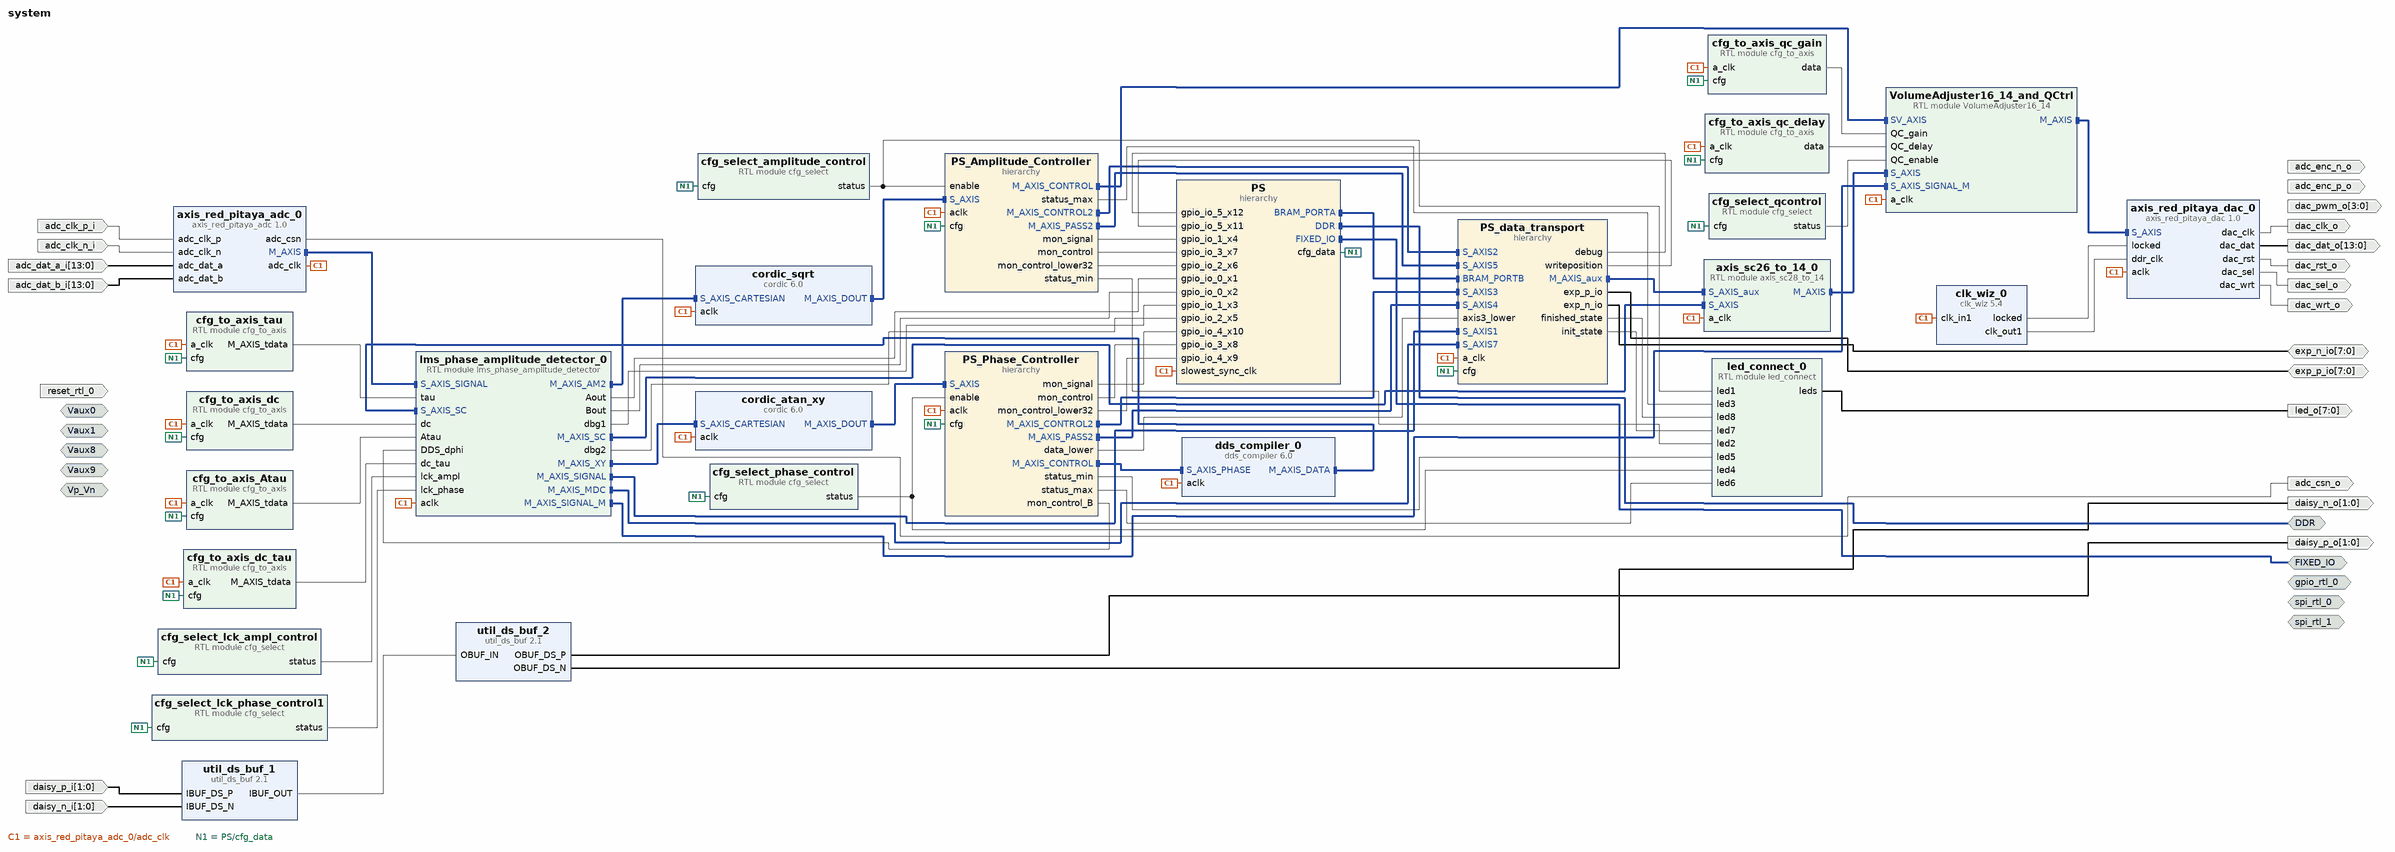
[diagram p0: block diagram of the top level]
# Vivado block design system, xc7z010clg400-1, Vivado 2017.4
create_bd_design system

create_bd_intf_port -mode Master -vlnv xilinx.com:interface:ddrx_rtl:1.0 DDR
create_bd_intf_port -mode Master -vlnv xilinx.com:display_processing_system7:fixedio_rtl:1.0 FIXED_IO
create_bd_intf_port -mode Master -vlnv xilinx.com:interface:spi_rtl:1.0 spi_rtl_0
create_bd_intf_port -mode Slave -vlnv xilinx.com:interface:diff_analog_io_rtl:1.0 Vp_Vn
create_bd_intf_port -mode Slave -vlnv xilinx.com:interface:diff_analog_io_rtl:1.0 Vaux0
create_bd_intf_port -mode Slave -vlnv xilinx.com:interface:diff_analog_io_rtl:1.0 Vaux1
create_bd_intf_port -mode Slave -vlnv xilinx.com:interface:diff_analog_io_rtl:1.0 Vaux9
create_bd_intf_port -mode Slave -vlnv xilinx.com:interface:diff_analog_io_rtl:1.0 Vaux8
create_bd_intf_port -mode Master -vlnv xilinx.com:interface:gpio_rtl:1.0 gpio_rtl_0
create_bd_intf_port -mode Master -vlnv xilinx.com:interface:spi_rtl:1.0 spi_rtl_1
create_bd_port -dir O adc_enc_p_o
create_bd_port -dir O adc_enc_n_o
create_bd_port -dir O -from 3 -to 0 dac_pwm_o
create_bd_port -dir I -type rst reset_rtl_0
set_property -dict {CONFIG.POLARITY ACTIVE_HIGH} [get_bd_ports reset_rtl_0]
create_bd_port -dir I adc_clk_p_i
create_bd_port -dir I adc_clk_n_i
create_bd_port -dir I -from 1 -to 0 daisy_p_i
create_bd_port -dir I -from 1 -to 0 daisy_n_i
create_bd_port -dir O -from 1 -to 0 daisy_p_o
create_bd_port -dir O -from 1 -to 0 daisy_n_o
create_bd_port -dir I -from 13 -to 0 adc_dat_a_i
create_bd_port -dir I -from 13 -to 0 adc_dat_b_i
create_bd_port -dir O dac_rst_o
create_bd_port -dir O dac_sel_o
create_bd_port -dir O dac_wrt_o
create_bd_port -dir O dac_clk_o
create_bd_port -dir O -from 13 -to 0 dac_dat_o
create_bd_port -dir O adc_csn_o
create_bd_port -dir O -from 7 -to 0 led_o
create_bd_port -dir IO -from 7 -to 0 exp_p_io
create_bd_port -dir IO -from 7 -to 0 exp_n_io

create_bd_cell -type ip -vlnv xilinx.com:ip:util_ds_buf:2.1 util_ds_buf_1
set_property -dict {CONFIG.C_SIZE 2} [get_bd_cells util_ds_buf_1]
create_bd_cell -type ip -vlnv xilinx.com:ip:util_ds_buf:2.1 util_ds_buf_2
set_property -dict {CONFIG.C_SIZE 2 CONFIG.C_BUF_TYPE OBUFDS} [get_bd_cells util_ds_buf_2]
create_bd_cell -type ip -vlnv pavel-demin:user:axis_red_pitaya_adc:1.0 axis_red_pitaya_adc_0
create_bd_cell -type ip -vlnv pavel-demin:user:axis_red_pitaya_dac:1.0 axis_red_pitaya_dac_0
create_bd_cell -type hier PS
create_bd_cell -type hier PS_Amplitude_Controller
create_bd_cell -type hier PS_Phase_Controller
create_bd_cell -type hier PS_data_transport
create_bd_cell -type module -reference cfg_select cfg_select_amplitude_control
set_property -dict {CONFIG.SRC_ADDR 3 CONFIG.CFG_SWBIT 1} [get_bd_cells cfg_select_amplitude_control]
create_bd_cell -type module -reference cfg_select cfg_select_phase_control
set_property -dict {CONFIG.SRC_ADDR 3} [get_bd_cells cfg_select_phase_control]
create_bd_cell -type ip -vlnv xilinx.com:ip:clk_wiz:5.4 clk_wiz_0
set_property -dict [list \
  CONFIG.PRIM_IN_FREQ 125 \
  CONFIG.USE_INCLK_SWITCHOVER false \
  CONFIG.SECONDARY_SOURCE Single_ended_clock_capable_pin \
  CONFIG.CLKIN1_JITTER_PS 80.0 \
  CONFIG.CLKIN2_JITTER_PS 166.66 \
  CONFIG.CLKOUT1_REQUESTED_OUT_FREQ 250 \
  CONFIG.USE_RESET false \
  CONFIG.MMCM_DIVCLK_DIVIDE 1 \
  CONFIG.MMCM_CLKFBOUT_MULT_F 8.000 \
  CONFIG.MMCM_CLKIN1_PERIOD 8.000 \
  CONFIG.MMCM_CLKIN2_PERIOD 10.000 \
  CONFIG.MMCM_CLKOUT0_DIVIDE_F 4.000 \
  CONFIG.CLKOUT1_JITTER 104.759 \
  CONFIG.CLKOUT1_PHASE_ERROR 96.948 \
] [get_bd_cells clk_wiz_0]
create_bd_cell -type ip -vlnv xilinx.com:ip:cordic:6.0 cordic_sqrt
set_property -dict [list \
  CONFIG.Functional_Selection Square_Root \
  CONFIG.Pipelining_Mode Optimal \
  CONFIG.Data_Format UnsignedFraction \
  CONFIG.Input_Width 45 \
  CONFIG.Output_Width 24 \
  CONFIG.Coarse_Rotation false \
] [get_bd_cells cordic_sqrt]
create_bd_cell -type ip -vlnv xilinx.com:ip:cordic:6.0 cordic_atan_xy
set_property -dict [list \
  CONFIG.Functional_Selection Arc_Tan \
  CONFIG.Pipelining_Mode Optimal \
  CONFIG.Data_Format SignedFraction \
  CONFIG.Input_Width 28 \
  CONFIG.Output_Width 24 \
  CONFIG.Coarse_Rotation true \
] [get_bd_cells cordic_atan_xy]
create_bd_cell -type ip -vlnv xilinx.com:ip:dds_compiler:6.0 dds_compiler_0
set_property -dict [list \
  CONFIG.DDS_Clock_Rate 125 \
  CONFIG.Spurious_Free_Dynamic_Range 150 \
  CONFIG.Frequency_Resolution 0.00001 \
  CONFIG.Noise_Shaping Auto \
  CONFIG.Phase_Width 44 \
  CONFIG.Output_Width 26 \
  CONFIG.Phase_Increment Streaming \
  CONFIG.Phase_offset None \
  CONFIG.Has_Phase_Out false \
  CONFIG.DATA_Has_TLAST Not_Required \
  CONFIG.S_PHASE_Has_TUSER Not_Required \
  CONFIG.M_DATA_Has_TUSER Not_Required \
  CONFIG.Latency 10 \
  CONFIG.Output_Frequency1 0 \
  CONFIG.PINC1 0 \
] [get_bd_cells dds_compiler_0]
create_bd_cell -type module -reference cfg_to_axis cfg_to_axis_tau
set_property -dict {CONFIG.SRC_ADDR 4 CONFIG.DST_WIDTH 32 CONFIG.MAXIS_TDATA_WIDTH 32} [get_bd_cells cfg_to_axis_tau]
create_bd_cell -type module -reference cfg_to_axis cfg_to_axis_dc
set_property -dict {CONFIG.SRC_ADDR 5 CONFIG.DST_WIDTH 32 CONFIG.MAXIS_TDATA_WIDTH 32} [get_bd_cells cfg_to_axis_dc]
create_bd_cell -type module -reference led_connect led_connect_0
create_bd_cell -type module -reference axis_sc28_to_14 axis_sc26_to_14_0
set_property -dict {CONFIG.SRC_BITS 26} [get_bd_cells axis_sc26_to_14_0]
create_bd_cell -type module -reference cfg_to_axis cfg_to_axis_Atau
set_property -dict {CONFIG.SRC_ADDR 27} [get_bd_cells cfg_to_axis_Atau]
create_bd_cell -type module -reference cfg_to_axis cfg_to_axis_dc_tau
set_property -dict {CONFIG.SRC_ADDR 28} [get_bd_cells cfg_to_axis_dc_tau]
create_bd_cell -type module -reference cfg_to_axis cfg_to_axis_qc_gain
set_property -dict {CONFIG.SRC_ADDR 29 CONFIG.SRC_BITS 32 CONFIG.DST_WIDTH 16} [get_bd_cells cfg_to_axis_qc_gain]
create_bd_cell -type module -reference cfg_to_axis cfg_to_axis_qc_delay
set_property -dict {CONFIG.SRC_ADDR 29 CONFIG.SRC_BITS 16 CONFIG.DST_WIDTH 16} [get_bd_cells cfg_to_axis_qc_delay]
create_bd_cell -type module -reference cfg_select cfg_select_qcontrol
set_property -dict {CONFIG.SRC_ADDR 3 CONFIG.CFG_SWBIT 3} [get_bd_cells cfg_select_qcontrol]
create_bd_cell -type module -reference VolumeAdjuster16_14 VolumeAdjuster16_14_and_QCtrl
create_bd_cell -type module -reference cfg_select cfg_select_lck_ampl_control
set_property -dict {CONFIG.SRC_ADDR 3 CONFIG.CFG_SWBIT 4} [get_bd_cells cfg_select_lck_ampl_control]
create_bd_cell -type module -reference cfg_select cfg_select_lck_phase_control1
set_property -dict {CONFIG.SRC_ADDR 3 CONFIG.CFG_SWBIT 5} [get_bd_cells cfg_select_lck_phase_control1]
create_bd_cell -type module -reference lms_phase_amplitude_detector lms_phase_amplitude_detector_0
set_property -dict {CONFIG.SC_DATA_WIDTH 26} [get_bd_cells lms_phase_amplitude_detector_0]

# ---- hierarchy /PS ----
current_bd_instance /PS
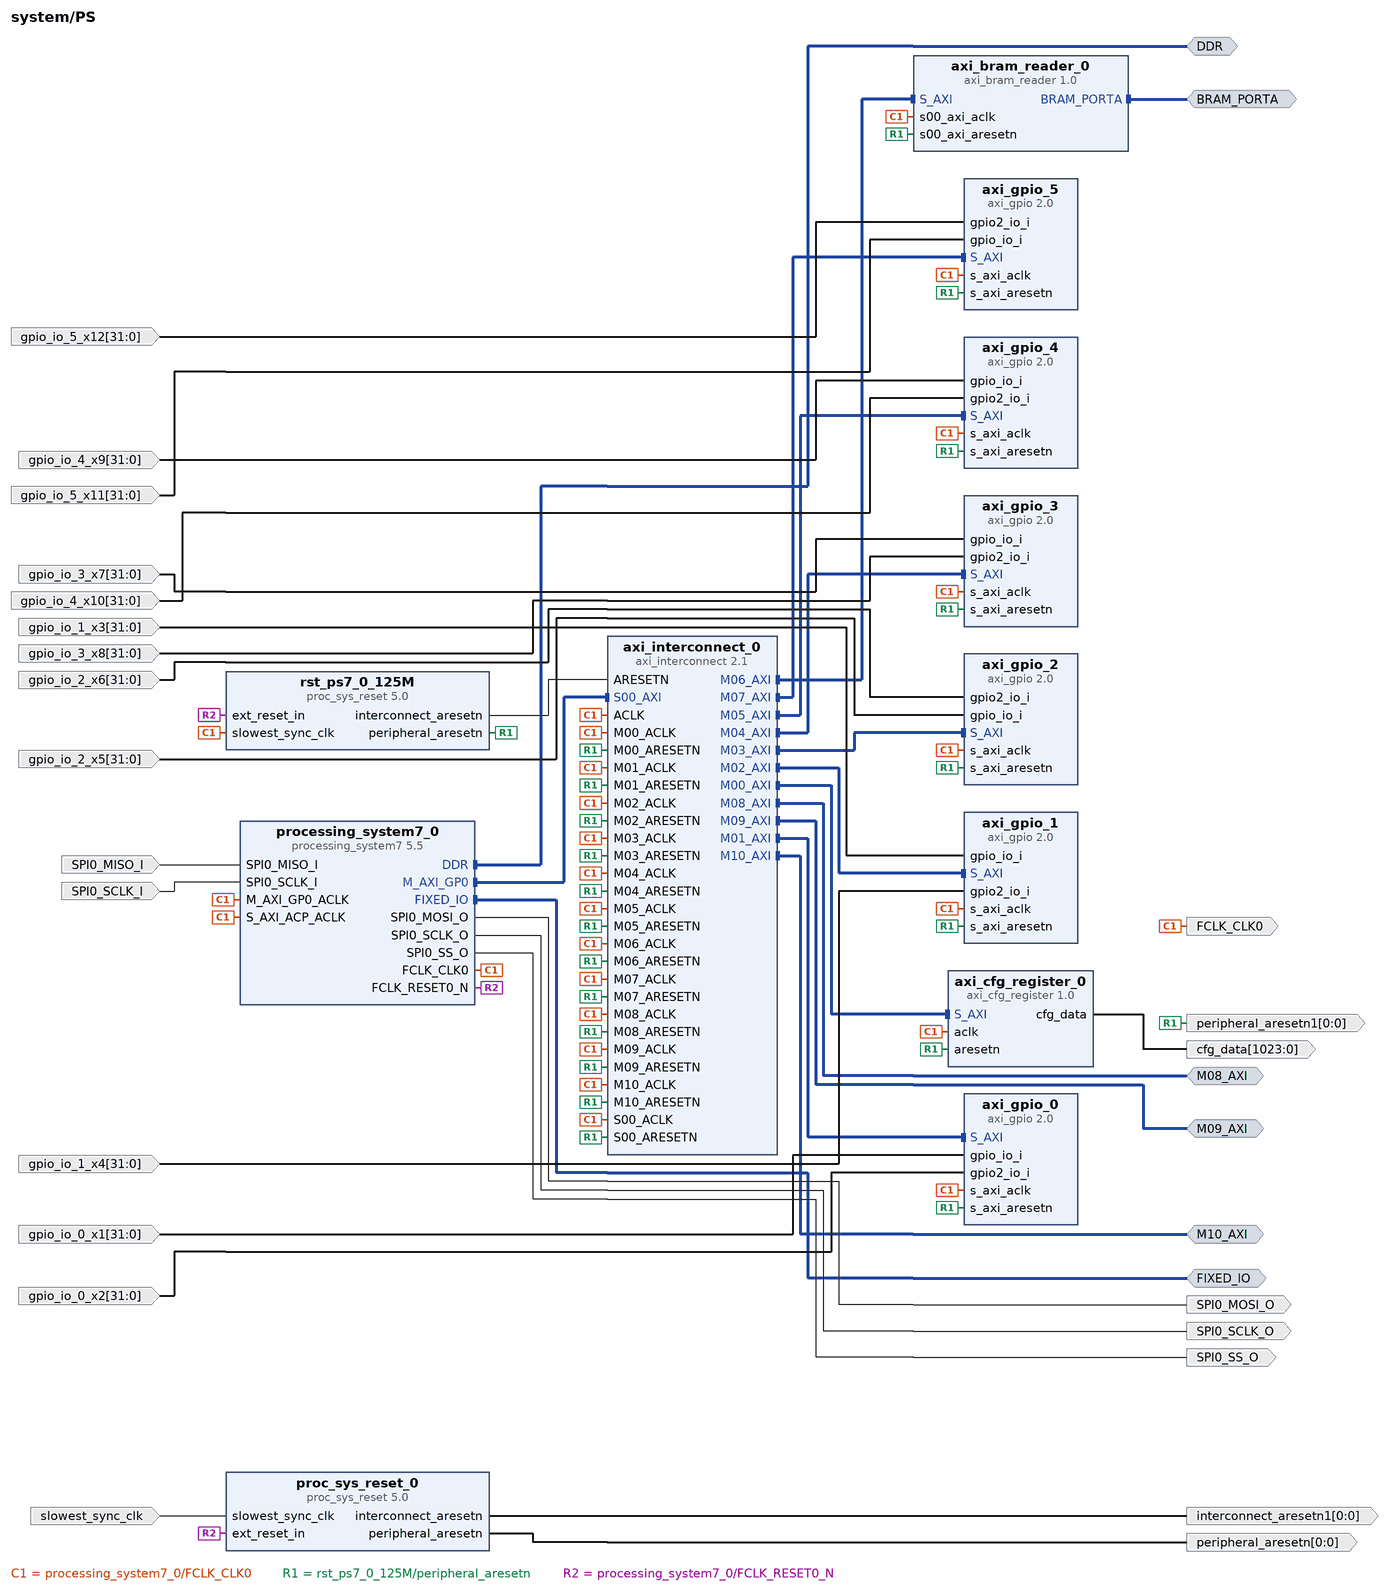
[diagram p1: block diagram inside /PS]
create_bd_intf_pin -mode Master -vlnv xilinx.com:interface:ddrx_rtl:1.0 DDR
create_bd_intf_pin -mode Master -vlnv xilinx.com:display_processing_system7:fixedio_rtl:1.0 FIXED_IO
create_bd_intf_pin -mode Master -vlnv xilinx.com:interface:bram_rtl:1.0 BRAM_PORTA
create_bd_intf_pin -mode Master -vlnv xilinx.com:interface:aximm_rtl:1.0 M08_AXI
create_bd_intf_pin -mode Master -vlnv xilinx.com:interface:aximm_rtl:1.0 M09_AXI
create_bd_intf_pin -mode Master -vlnv xilinx.com:interface:aximm_rtl:1.0 M10_AXI
create_bd_pin -dir O -from 1023 -to 0 cfg_data
create_bd_pin -dir I -from 31 -to 0 gpio_io_0_x1
create_bd_pin -dir I -from 31 -to 0 gpio_io_0_x2
create_bd_pin -dir I -type clk slowest_sync_clk
create_bd_pin -dir O -from 0 -to 0 -type rst peripheral_aresetn
create_bd_pin -dir O -from 0 -to 0 -type rst interconnect_aresetn1
create_bd_pin -dir I -from 31 -to 0 gpio_io_1_x3
create_bd_pin -dir I -from 31 -to 0 gpio_io_1_x4
create_bd_pin -dir I -from 31 -to 0 gpio_io_3_x7
create_bd_pin -dir I -from 31 -to 0 gpio_io_3_x8
create_bd_pin -dir I -from 31 -to 0 gpio_io_2_x6
create_bd_pin -dir I -from 31 -to 0 gpio_io_2_x5
create_bd_pin -dir I -from 31 -to 0 gpio_io_4_x9
create_bd_pin -dir I -from 31 -to 0 gpio_io_4_x10
create_bd_pin -dir O -from 0 -to 0 -type rst peripheral_aresetn1
create_bd_pin -dir I -from 31 -to 0 gpio_io_5_x12
create_bd_pin -dir I -from 31 -to 0 gpio_io_5_x11
create_bd_pin -dir O -type clk FCLK_CLK0
create_bd_pin -dir I SPI0_MISO_I
create_bd_pin -dir O SPI0_MOSI_O
create_bd_pin -dir O SPI0_SCLK_O
create_bd_pin -dir O SPI0_SS_O
create_bd_pin -dir I SPI0_SCLK_I

create_bd_cell -type ip -vlnv xilinx.com:ip:processing_system7:5.5 processing_system7_0
set_property -dict [list \
  CONFIG.PCW_FCLK_CLK1_BUF TRUE \
  CONFIG.PCW_UIPARAM_DDR_FREQ_MHZ 533.333333 \
  CONFIG.PCW_APU_PERIPHERAL_FREQMHZ 666.666666 \
  CONFIG.PCW_QSPI_PERIPHERAL_FREQMHZ 125 \
  CONFIG.PCW_SDIO_PERIPHERAL_FREQMHZ 100 \
  CONFIG.PCW_UART_PERIPHERAL_FREQMHZ 100 \
  CONFIG.PCW_I2C_PERIPHERAL_FREQMHZ 111.111115 \
  CONFIG.PCW_FPGA0_PERIPHERAL_FREQMHZ 100 \
  CONFIG.PCW_FPGA1_PERIPHERAL_FREQMHZ 20 \
  CONFIG.PCW_FPGA3_PERIPHERAL_FREQMHZ 200 \
  CONFIG.PCW_USE_S_AXI_ACP 1 \
  CONFIG.PCW_EN_CLK1_PORT 1 \
  CONFIG.PCW_IMPORT_BOARD_PRESET cfg/red_pitaya.xml \
  CONFIG.PCW_PRESET_BANK1_VOLTAGE {LVCMOS 2.5V} \
  CONFIG.PCW_UIPARAM_DDR_BUS_WIDTH {16 Bit} \
  CONFIG.PCW_UIPARAM_DDR_PARTNO {MT41J256M16 RE-125} \
  CONFIG.PCW_QSPI_PERIPHERAL_ENABLE 1 \
  CONFIG.PCW_QSPI_QSPI_IO {MIO 1 .. 6} \
  CONFIG.PCW_QSPI_GRP_SINGLE_SS_ENABLE 1 \
  CONFIG.PCW_QSPI_GRP_SINGLE_SS_IO {MIO 1 .. 6} \
  CONFIG.PCW_SINGLE_QSPI_DATA_MODE x4 \
  CONFIG.PCW_ENET0_PERIPHERAL_ENABLE 1 \
  CONFIG.PCW_ENET0_ENET0_IO {MIO 16 .. 27} \
  CONFIG.PCW_ENET0_GRP_MDIO_ENABLE 1 \
  CONFIG.PCW_ENET0_GRP_MDIO_IO EMIO \
  CONFIG.PCW_ENET_RESET_ENABLE 1 \
  CONFIG.PCW_ENET_RESET_SELECT {Share reset pin} \
  CONFIG.PCW_ENET0_RESET_ENABLE 0 \
  CONFIG.PCW_SD0_PERIPHERAL_ENABLE 1 \
  CONFIG.PCW_SD0_SD0_IO {MIO 40 .. 45} \
  CONFIG.PCW_SD0_GRP_CD_ENABLE 1 \
  CONFIG.PCW_SD0_GRP_CD_IO {MIO 46} \
  CONFIG.PCW_SD0_GRP_WP_ENABLE 1 \
  CONFIG.PCW_SD0_GRP_WP_IO {MIO 47} \
  CONFIG.PCW_UART0_PERIPHERAL_ENABLE 1 \
  CONFIG.PCW_UART0_UART0_IO {MIO 14 .. 15} \
  CONFIG.PCW_UART1_PERIPHERAL_ENABLE 1 \
  CONFIG.PCW_UART1_UART1_IO {MIO 8 .. 9} \
  CONFIG.PCW_SPI0_PERIPHERAL_ENABLE 1 \
  CONFIG.PCW_SPI0_SPI0_IO EMIO \
  CONFIG.PCW_SPI1_PERIPHERAL_ENABLE 1 \
  CONFIG.PCW_SPI1_SPI1_IO {MIO 10 .. 15} \
  CONFIG.PCW_TTC0_PERIPHERAL_ENABLE 1 \
  CONFIG.PCW_TTC0_TTC0_IO EMIO \
  CONFIG.PCW_USB0_PERIPHERAL_ENABLE 1 \
  CONFIG.PCW_USB0_USB0_IO {MIO 28 .. 39} \
  CONFIG.PCW_USB_RESET_ENABLE 1 \
  CONFIG.PCW_USB_RESET_SELECT {Share reset pin} \
  CONFIG.PCW_USB0_RESET_ENABLE 1 \
  CONFIG.PCW_USB0_RESET_IO {MIO 48} \
  CONFIG.PCW_I2C0_PERIPHERAL_ENABLE 1 \
  CONFIG.PCW_I2C0_I2C0_IO {MIO 50 .. 51} \
  CONFIG.PCW_I2C0_GRP_INT_ENABLE 0 \
  CONFIG.PCW_I2C_RESET_ENABLE 1 \
  CONFIG.PCW_I2C_RESET_SELECT {Share reset pin} \
  CONFIG.PCW_GPIO_PERIPHERAL_ENABLE 1 \
  CONFIG.PCW_GPIO_MIO_GPIO_ENABLE 1 \
  CONFIG.PCW_GPIO_MIO_GPIO_IO MIO \
  CONFIG.PCW_FPGA_FCLK1_ENABLE 1 \
] [get_bd_cells processing_system7_0]
# 430 more settings of processing_system7_0 are not shown: defaults, MIO pin electricals, DDR timing, and values the tool derives
create_bd_cell -type ip -vlnv xilinx.com:ip:proc_sys_reset:5.0 rst_ps7_0_125M
create_bd_cell -type ip -vlnv pavel-demin:user:axi_cfg_register:1.0 axi_cfg_register_0
create_bd_cell -type ip -vlnv xilinx.com:ip:proc_sys_reset:5.0 proc_sys_reset_0
create_bd_cell -type ip -vlnv anton-potocnik:user:axi_bram_reader:1.0 axi_bram_reader_0
set_property -dict [list \
  CONFIG.BRAM_DATA_WIDTH 64 \
  CONFIG.BRAM_ADDR_WIDTH 15 \
  CONFIG.C_S00_AXI_ADDR_WIDTH 17 \
] [get_bd_cells axi_bram_reader_0]
create_bd_cell -type ip -vlnv xilinx.com:ip:axi_gpio:2.0 axi_gpio_0
set_property -dict {CONFIG.C_IS_DUAL 1 CONFIG.C_ALL_INPUTS 1 CONFIG.C_ALL_INPUTS_2 1} [get_bd_cells axi_gpio_0]
create_bd_cell -type ip -vlnv xilinx.com:ip:axi_gpio:2.0 axi_gpio_1
set_property -dict {CONFIG.C_IS_DUAL 1 CONFIG.C_ALL_INPUTS 1 CONFIG.C_ALL_INPUTS_2 1} [get_bd_cells axi_gpio_1]
create_bd_cell -type ip -vlnv xilinx.com:ip:axi_gpio:2.0 axi_gpio_2
set_property -dict {CONFIG.C_IS_DUAL 1 CONFIG.C_ALL_INPUTS 1 CONFIG.C_ALL_INPUTS_2 1} [get_bd_cells axi_gpio_2]
create_bd_cell -type ip -vlnv xilinx.com:ip:axi_gpio:2.0 axi_gpio_3
set_property -dict {CONFIG.C_IS_DUAL 1 CONFIG.C_ALL_INPUTS 1 CONFIG.C_ALL_INPUTS_2 1} [get_bd_cells axi_gpio_3]
create_bd_cell -type ip -vlnv xilinx.com:ip:axi_gpio:2.0 axi_gpio_4
set_property -dict {CONFIG.C_IS_DUAL 1 CONFIG.C_ALL_INPUTS 1 CONFIG.C_ALL_INPUTS_2 1} [get_bd_cells axi_gpio_4]
create_bd_cell -type ip -vlnv xilinx.com:ip:axi_gpio:2.0 axi_gpio_5
set_property -dict {CONFIG.C_IS_DUAL 1 CONFIG.C_ALL_INPUTS 1 CONFIG.C_ALL_INPUTS_2 1} [get_bd_cells axi_gpio_5]
create_bd_cell -type ip -vlnv xilinx.com:ip:axi_interconnect:2.1 axi_interconnect_0
set_property -dict {CONFIG.NUM_MI 11} [get_bd_cells axi_interconnect_0]

# ---- hierarchy /PS_Amplitude_Controller ----
current_bd_instance /PS_Amplitude_Controller
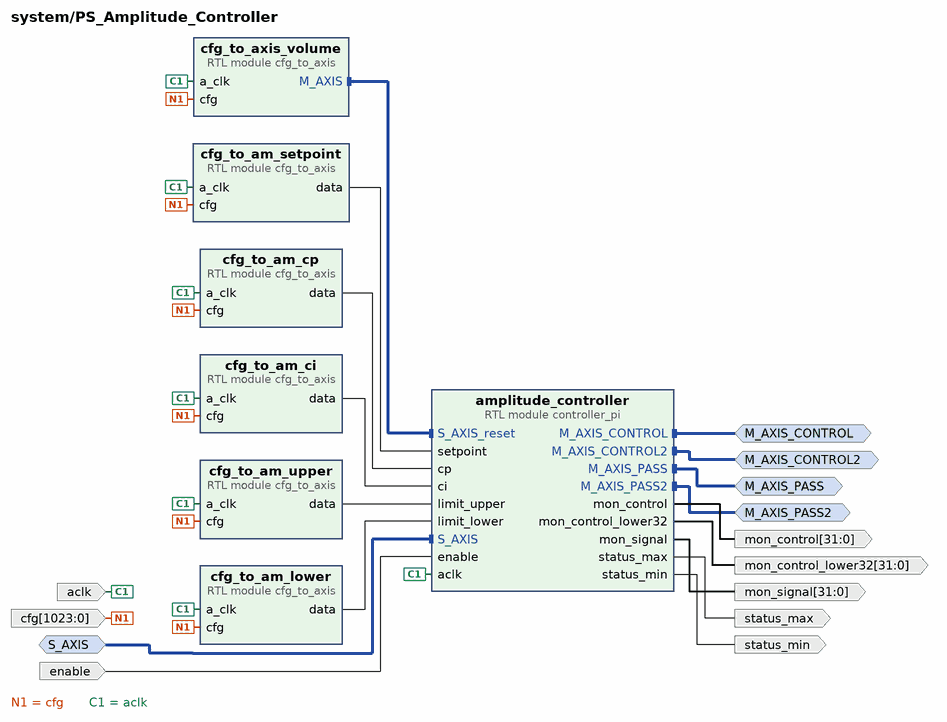
[diagram p2: block diagram inside /PS_Amplitude_Controller]
create_bd_intf_pin -mode Master -vlnv xilinx.com:interface:axis_rtl:1.0 M_AXIS_CONTROL
create_bd_intf_pin -mode Master -vlnv xilinx.com:interface:axis_rtl:1.0 M_AXIS_PASS
create_bd_intf_pin -mode Slave -vlnv xilinx.com:interface:axis_rtl:1.0 S_AXIS
create_bd_intf_pin -mode Master -vlnv xilinx.com:interface:axis_rtl:1.0 M_AXIS_CONTROL2
create_bd_intf_pin -mode Master -vlnv xilinx.com:interface:axis_rtl:1.0 M_AXIS_PASS2
create_bd_pin -dir I -from 1023 -to 0 cfg
create_bd_pin -dir I -type clk aclk
create_bd_pin -dir O -from 31 -to 0 mon_signal
create_bd_pin -dir I enable
create_bd_pin -dir O status_max
create_bd_pin -dir O status_min
create_bd_pin -dir O -from 31 -to 0 mon_control
create_bd_pin -dir O -from 31 -to 0 mon_control_lower32

create_bd_cell -type module -reference cfg_to_axis cfg_to_am_ci
set_property -dict {CONFIG.SRC_ADDR 22 CONFIG.DST_WIDTH 32 CONFIG.MAXIS_TDATA_WIDTH 32} [get_bd_cells cfg_to_am_ci]
create_bd_cell -type module -reference cfg_to_axis cfg_to_am_upper
set_property -dict {CONFIG.SRC_ADDR 23 CONFIG.DST_WIDTH 16 CONFIG.MAXIS_TDATA_WIDTH 32} [get_bd_cells cfg_to_am_upper]
create_bd_cell -type module -reference cfg_to_axis cfg_to_am_cp
set_property -dict {CONFIG.SRC_ADDR 21 CONFIG.DST_WIDTH 32 CONFIG.MAXIS_TDATA_WIDTH 32} [get_bd_cells cfg_to_am_cp]
create_bd_cell -type module -reference cfg_to_axis cfg_to_am_lower
set_property -dict {CONFIG.SRC_ADDR 25 CONFIG.DST_WIDTH 16 CONFIG.MAXIS_TDATA_WIDTH 32} [get_bd_cells cfg_to_am_lower]
create_bd_cell -type module -reference cfg_to_axis cfg_to_axis_volume
set_property -dict {CONFIG.SRC_ADDR 2 CONFIG.DST_WIDTH 16 CONFIG.MAXIS_TDATA_WIDTH 16} [get_bd_cells cfg_to_axis_volume]
create_bd_cell -type module -reference cfg_to_axis cfg_to_am_setpoint
set_property -dict {CONFIG.SRC_ADDR 20 CONFIG.DST_WIDTH 24 CONFIG.MAXIS_TDATA_WIDTH 32} [get_bd_cells cfg_to_am_setpoint]
create_bd_cell -type module -reference controller_pi amplitude_controller
set_property -dict [list \
  CONFIG.AXIS_TDATA_WIDTH 24 \
  CONFIG.M_AXIS_CONTROL_TDATA_WIDTH 16 \
  CONFIG.CONTROL_WIDTH 16 \
  CONFIG.CONTROL2_WIDTH 56 \
  CONFIG.CONTROL2_OUT_WIDTH 32 \
  CONFIG.AMCONTROL_ALLOW_NEG_SPECIAL 1 \
] [get_bd_cells amplitude_controller]

# ---- hierarchy /PS_Phase_Controller ----
current_bd_instance /PS_Phase_Controller
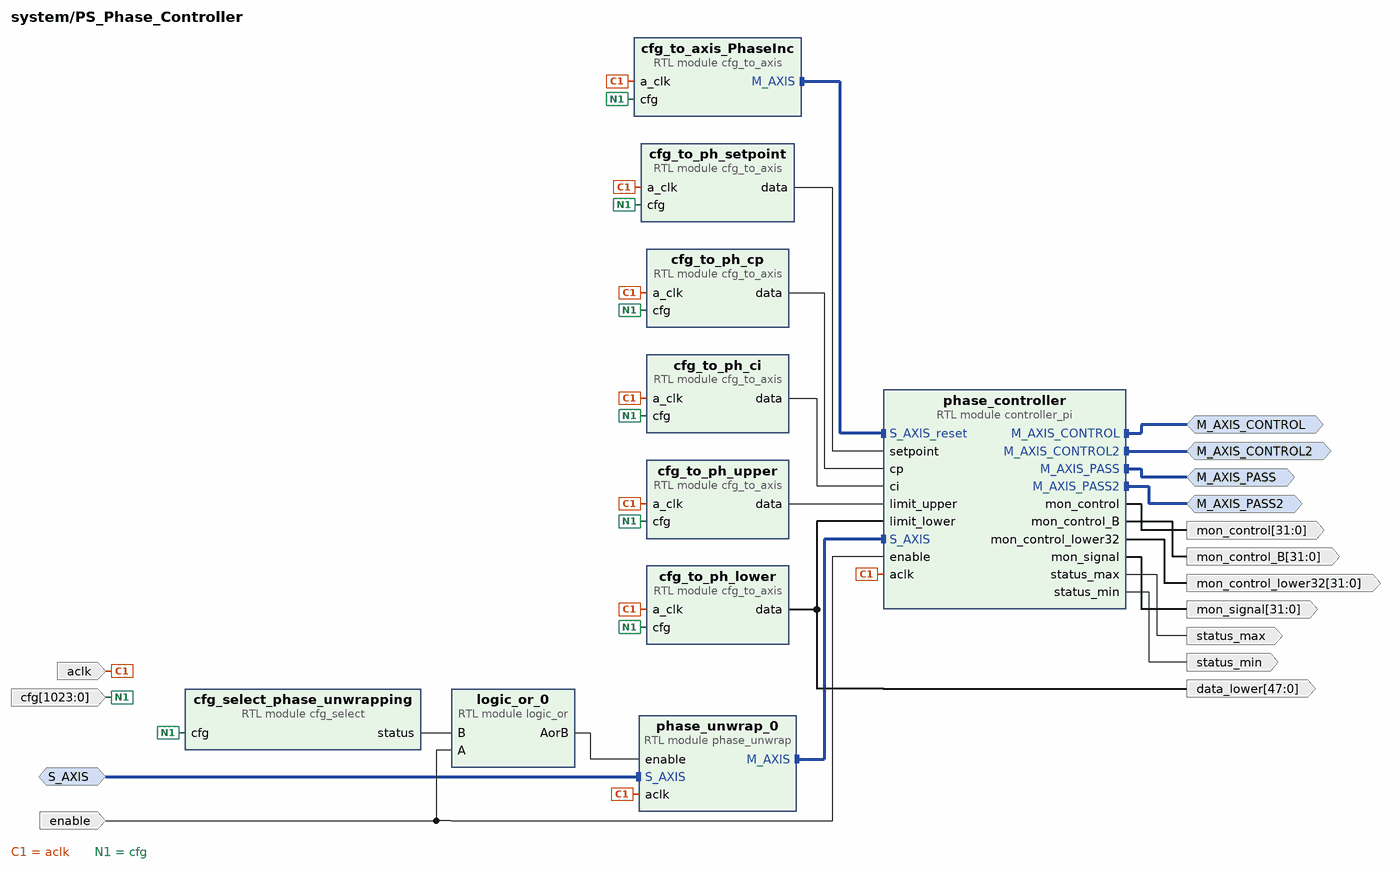
[diagram p3: block diagram inside /PS_Phase_Controller]
create_bd_intf_pin -mode Master -vlnv xilinx.com:interface:axis_rtl:1.0 M_AXIS_CONTROL
create_bd_intf_pin -mode Master -vlnv xilinx.com:interface:axis_rtl:1.0 M_AXIS_PASS
create_bd_intf_pin -mode Slave -vlnv xilinx.com:interface:axis_rtl:1.0 S_AXIS
create_bd_intf_pin -mode Master -vlnv xilinx.com:interface:axis_rtl:1.0 M_AXIS_CONTROL2
create_bd_intf_pin -mode Master -vlnv xilinx.com:interface:axis_rtl:1.0 M_AXIS_PASS2
create_bd_pin -dir I -type clk aclk
create_bd_pin -dir I -from 1023 -to 0 cfg
create_bd_pin -dir O -from 31 -to 0 mon_signal
create_bd_pin -dir I enable
create_bd_pin -dir O -from 47 -to 0 data_lower
create_bd_pin -dir O status_min
create_bd_pin -dir O status_max
create_bd_pin -dir O -from 31 -to 0 mon_control
create_bd_pin -dir O -from 31 -to 0 mon_control_lower32
create_bd_pin -dir O -from 31 -to 0 mon_control_B

create_bd_cell -type module -reference cfg_to_axis cfg_to_ph_ci
set_property -dict [list \
  CONFIG.SRC_ADDR 12 \
  CONFIG.SRC_BITS 32 \
  CONFIG.DST_WIDTH 32 \
  CONFIG.MAXIS_TDATA_WIDTH 32 \
] [get_bd_cells cfg_to_ph_ci]
create_bd_cell -type module -reference cfg_to_axis cfg_to_ph_cp
set_property -dict [list \
  CONFIG.SRC_ADDR 11 \
  CONFIG.SRC_BITS 32 \
  CONFIG.DST_WIDTH 32 \
  CONFIG.MAXIS_TDATA_WIDTH 32 \
] [get_bd_cells cfg_to_ph_cp]
create_bd_cell -type module -reference cfg_to_axis cfg_to_ph_upper
set_property -dict [list \
  CONFIG.SRC_ADDR 13 \
  CONFIG.SRC_BITS 64 \
  CONFIG.DST_WIDTH 48 \
  CONFIG.MAXIS_TDATA_WIDTH 48 \
] [get_bd_cells cfg_to_ph_upper]
create_bd_cell -type module -reference cfg_to_axis cfg_to_ph_setpoint
set_property -dict {CONFIG.SRC_ADDR 10 CONFIG.DST_WIDTH 32 CONFIG.MAXIS_TDATA_WIDTH 32} [get_bd_cells cfg_to_ph_setpoint]
create_bd_cell -type module -reference cfg_to_axis cfg_to_ph_lower
set_property -dict [list \
  CONFIG.SRC_ADDR 15 \
  CONFIG.SRC_BITS 64 \
  CONFIG.DST_WIDTH 48 \
  CONFIG.MAXIS_TDATA_WIDTH 48 \
] [get_bd_cells cfg_to_ph_lower]
create_bd_cell -type module -reference cfg_to_axis cfg_to_axis_PhaseInc
set_property -dict {CONFIG.SRC_BITS 64 CONFIG.DST_WIDTH 48 CONFIG.MAXIS_TDATA_WIDTH 48} [get_bd_cells cfg_to_axis_PhaseInc]
create_bd_cell -type module -reference cfg_select cfg_select_phase_unwrapping
set_property -dict {CONFIG.SRC_ADDR 3 CONFIG.CFG_SWBIT 2} [get_bd_cells cfg_select_phase_unwrapping]
create_bd_cell -type module -reference phase_unwrap phase_unwrap_0
create_bd_cell -type module -reference logic_or logic_or_0
create_bd_cell -type module -reference controller_pi phase_controller
set_property -dict [list \
  CONFIG.AXIS_TDATA_WIDTH 32 \
  CONFIG.M_AXIS_CONTROL_TDATA_WIDTH 48 \
  CONFIG.CONTROL_WIDTH 44 \
  CONFIG.M_AXIS_CONTROL2_TDATA_WIDTH 48 \
  CONFIG.CONTROL2_WIDTH 75 \
  CONFIG.CONTROL2_OUT_WIDTH 44 \
  CONFIG.CEXTEND 1 \
  CONFIG.AMCONTROL_ALLOW_NEG_SPECIAL 0 \
] [get_bd_cells phase_controller]

# ---- hierarchy /PS_data_transport ----
current_bd_instance /PS_data_transport
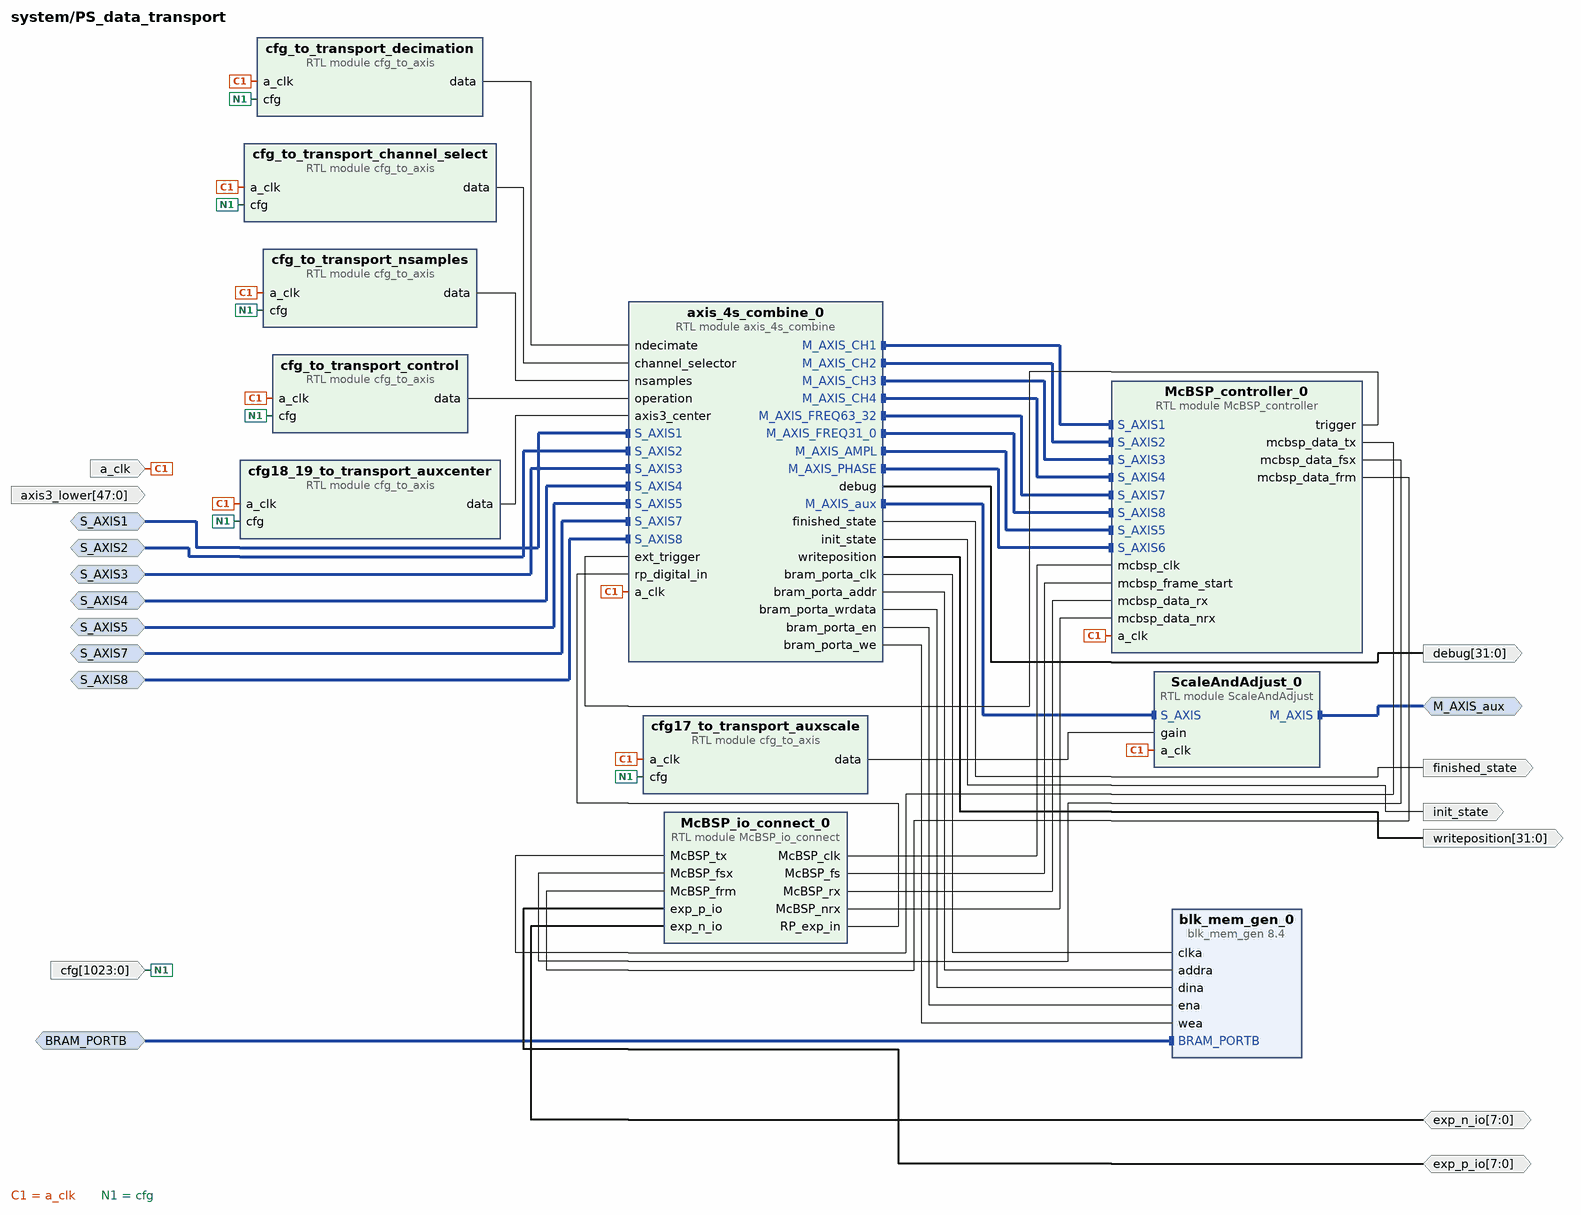
[diagram p4: block diagram inside /PS_data_transport]
create_bd_intf_pin -mode Slave -vlnv xilinx.com:interface:axis_rtl:1.0 S_AXIS1
create_bd_intf_pin -mode Slave -vlnv xilinx.com:interface:axis_rtl:1.0 S_AXIS2
create_bd_intf_pin -mode Slave -vlnv xilinx.com:interface:axis_rtl:1.0 S_AXIS3
create_bd_intf_pin -mode Slave -vlnv xilinx.com:interface:axis_rtl:1.0 S_AXIS4
create_bd_intf_pin -mode Slave -vlnv xilinx.com:interface:axis_rtl:1.0 S_AXIS5
create_bd_intf_pin -mode Slave -vlnv xilinx.com:interface:bram_rtl:1.0 BRAM_PORTB
create_bd_intf_pin -mode Slave -vlnv xilinx.com:interface:axis_rtl:1.0 S_AXIS7
create_bd_intf_pin -mode Slave -vlnv xilinx.com:interface:axis_rtl:1.0 S_AXIS8
create_bd_intf_pin -mode Master -vlnv xilinx.com:interface:axis_rtl:1.0 M_AXIS_aux
create_bd_pin -dir I -type clk a_clk
create_bd_pin -dir I -from 1023 -to 0 cfg
create_bd_pin -dir O -from 31 -to 0 debug
create_bd_pin -dir O -from 31 -to 0 writeposition
create_bd_pin -dir I -from 47 -to 0 axis3_lower
create_bd_pin -dir O finished_state
create_bd_pin -dir O init_state
create_bd_pin -dir IO -from 7 -to 0 exp_p_io
create_bd_pin -dir IO -from 7 -to 0 exp_n_io

create_bd_cell -type ip -vlnv xilinx.com:ip:blk_mem_gen:8.4 blk_mem_gen_0
set_property -dict [list \
  CONFIG.Memory_Type Simple_Dual_Port_RAM \
  CONFIG.Enable_32bit_Address false \
  CONFIG.Use_Byte_Write_Enable false \
  CONFIG.Algorithm Minimum_Area \
  CONFIG.Write_Width_A 64 \
  CONFIG.Write_Depth_A 32768 \
  CONFIG.Operating_Mode_A NO_CHANGE \
  CONFIG.Write_Width_B 64 \
  CONFIG.Read_Width_B 64 \
  CONFIG.Enable_B Use_ENB_Pin \
  CONFIG.Register_PortB_Output_of_Memory_Primitives true \
  CONFIG.Use_RSTB_Pin false \
  CONFIG.Port_B_Clock 100 \
  CONFIG.Port_B_Enable_Rate 100 \
  CONFIG.use_bram_block Stand_Alone \
] [get_bd_cells blk_mem_gen_0]
create_bd_cell -type module -reference cfg_to_axis cfg_to_transport_decimation
set_property -dict {CONFIG.SRC_ADDR 8 CONFIG.DST_WIDTH 32 CONFIG.MAXIS_TDATA_WIDTH 32} [get_bd_cells cfg_to_transport_decimation]
create_bd_cell -type module -reference cfg_to_axis cfg_to_transport_channel_select
set_property -dict [list \
  CONFIG.SRC_ADDR 9 \
  CONFIG.DST_WIDTH 32 \
  CONFIG.MAXIS_TDATA_WIDTH 32 \
] [get_bd_cells cfg_to_transport_channel_select]
create_bd_cell -type module -reference cfg_to_axis cfg_to_transport_control
set_property -dict {CONFIG.SRC_ADDR 6 CONFIG.DST_WIDTH 32 CONFIG.MAXIS_TDATA_WIDTH 32} [get_bd_cells cfg_to_transport_control]
create_bd_cell -type module -reference cfg_to_axis cfg_to_transport_nsamples
set_property -dict {CONFIG.SRC_ADDR 7 CONFIG.DST_WIDTH 32 CONFIG.MAXIS_TDATA_WIDTH 32} [get_bd_cells cfg_to_transport_nsamples]
create_bd_cell -type module -reference cfg_to_axis cfg17_to_transport_auxscale
set_property -dict {CONFIG.SRC_ADDR 17 CONFIG.SRC_BITS 32 CONFIG.DST_WIDTH 32} [get_bd_cells cfg17_to_transport_auxscale]
create_bd_cell -type module -reference cfg_to_axis cfg18_19_to_transport_auxcenter
set_property -dict [list \
  CONFIG.SRC_ADDR 18 \
  CONFIG.SRC_BITS 64 \
  CONFIG.DST_WIDTH 48 \
  CONFIG.MAXIS_TDATA_WIDTH 48 \
] [get_bd_cells cfg18_19_to_transport_auxcenter]
create_bd_cell -type module -reference ScaleAndAdjust ScaleAndAdjust_0
set_property -dict {CONFIG.GAIN_DATA_Q 15} [get_bd_cells ScaleAndAdjust_0]
create_bd_cell -type module -reference McBSP_io_connect McBSP_io_connect_0
create_bd_cell -type module -reference axis_4s_combine axis_4s_combine_0
set_property -dict {CONFIG.BRAM_DATA_WIDTH 64 CONFIG.BRAM_ADDR_WIDTH 15} [get_bd_cells axis_4s_combine_0]
create_bd_cell -type module -reference McBSP_controller McBSP_controller_0

# ---- connections ----

current_bd_instance /PS
connect_bd_intf_net [get_bd_intf_pins processing_system7_0/M_AXI_GP0] [get_bd_intf_pins axi_interconnect_0/S00_AXI]
connect_bd_intf_net [get_bd_intf_pins axi_interconnect_0/M00_AXI] [get_bd_intf_pins axi_cfg_register_0/S_AXI]
connect_bd_intf_net [get_bd_intf_pins axi_gpio_0/S_AXI] [get_bd_intf_pins axi_interconnect_0/M01_AXI]
connect_bd_intf_net [get_bd_intf_pins axi_gpio_1/S_AXI] [get_bd_intf_pins axi_interconnect_0/M02_AXI]
connect_bd_intf_net [get_bd_intf_pins axi_gpio_2/S_AXI] [get_bd_intf_pins axi_interconnect_0/M03_AXI]
connect_bd_intf_net [get_bd_intf_pins axi_gpio_3/S_AXI] [get_bd_intf_pins axi_interconnect_0/M04_AXI]
connect_bd_intf_net [get_bd_intf_pins axi_gpio_4/S_AXI] [get_bd_intf_pins axi_interconnect_0/M05_AXI]
connect_bd_intf_net [get_bd_intf_pins axi_gpio_5/S_AXI] [get_bd_intf_pins axi_interconnect_0/M07_AXI]
connect_bd_intf_net [get_bd_intf_pins axi_interconnect_0/M06_AXI] [get_bd_intf_pins axi_bram_reader_0/S_AXI]
connect_bd_intf_net [get_bd_intf_pins DDR] [get_bd_intf_pins processing_system7_0/DDR]
connect_bd_intf_net [get_bd_intf_pins FIXED_IO] [get_bd_intf_pins processing_system7_0/FIXED_IO]
connect_bd_intf_net [get_bd_intf_pins BRAM_PORTA] [get_bd_intf_pins axi_bram_reader_0/BRAM_PORTA]
connect_bd_intf_net [get_bd_intf_pins M08_AXI] [get_bd_intf_pins axi_interconnect_0/M08_AXI]
connect_bd_intf_net [get_bd_intf_pins M09_AXI] [get_bd_intf_pins axi_interconnect_0/M09_AXI]
connect_bd_intf_net [get_bd_intf_pins M10_AXI] [get_bd_intf_pins axi_interconnect_0/M10_AXI]
connect_bd_net [get_bd_pins processing_system7_0/FCLK_CLK0] \
  [get_bd_pins FCLK_CLK0] [get_bd_pins rst_ps7_0_125M/slowest_sync_clk] [get_bd_pins processing_system7_0/M_AXI_GP0_ACLK] \
  [get_bd_pins axi_cfg_register_0/aclk] [get_bd_pins processing_system7_0/S_AXI_ACP_ACLK] \
  [get_bd_pins axi_bram_reader_0/s00_axi_aclk] [get_bd_pins axi_gpio_0/s_axi_aclk] [get_bd_pins axi_gpio_1/s_axi_aclk] \
  [get_bd_pins axi_gpio_2/s_axi_aclk] [get_bd_pins axi_gpio_3/s_axi_aclk] [get_bd_pins axi_gpio_4/s_axi_aclk] \
  [get_bd_pins axi_gpio_5/s_axi_aclk] [get_bd_pins axi_interconnect_0/ACLK] [get_bd_pins axi_interconnect_0/S00_ACLK] \
  [get_bd_pins axi_interconnect_0/M00_ACLK] [get_bd_pins axi_interconnect_0/M01_ACLK] \
  [get_bd_pins axi_interconnect_0/M02_ACLK] [get_bd_pins axi_interconnect_0/M03_ACLK] \
  [get_bd_pins axi_interconnect_0/M04_ACLK] [get_bd_pins axi_interconnect_0/M05_ACLK] \
  [get_bd_pins axi_interconnect_0/M06_ACLK] [get_bd_pins axi_interconnect_0/M07_ACLK] \
  [get_bd_pins axi_interconnect_0/M08_ACLK] [get_bd_pins axi_interconnect_0/M09_ACLK] \
  [get_bd_pins axi_interconnect_0/M10_ACLK]
connect_bd_net [get_bd_pins rst_ps7_0_125M/peripheral_aresetn] \
  [get_bd_pins peripheral_aresetn1] [get_bd_pins axi_cfg_register_0/aresetn] [get_bd_pins axi_bram_reader_0/s00_axi_aresetn] \
  [get_bd_pins axi_gpio_0/s_axi_aresetn] [get_bd_pins axi_gpio_1/s_axi_aresetn] [get_bd_pins axi_gpio_2/s_axi_aresetn] \
  [get_bd_pins axi_gpio_3/s_axi_aresetn] [get_bd_pins axi_gpio_4/s_axi_aresetn] [get_bd_pins axi_gpio_5/s_axi_aresetn] \
  [get_bd_pins axi_interconnect_0/S00_ARESETN] [get_bd_pins axi_interconnect_0/M00_ARESETN] \
  [get_bd_pins axi_interconnect_0/M01_ARESETN] [get_bd_pins axi_interconnect_0/M02_ARESETN] \
  [get_bd_pins axi_interconnect_0/M03_ARESETN] [get_bd_pins axi_interconnect_0/M04_ARESETN] \
  [get_bd_pins axi_interconnect_0/M05_ARESETN] [get_bd_pins axi_interconnect_0/M06_ARESETN] \
  [get_bd_pins axi_interconnect_0/M07_ARESETN] [get_bd_pins axi_interconnect_0/M08_ARESETN] \
  [get_bd_pins axi_interconnect_0/M09_ARESETN] [get_bd_pins axi_interconnect_0/M10_ARESETN]
connect_bd_net [get_bd_pins processing_system7_0/FCLK_RESET0_N] [get_bd_pins rst_ps7_0_125M/ext_reset_in] [get_bd_pins proc_sys_reset_0/ext_reset_in]
connect_bd_net [get_bd_pins rst_ps7_0_125M/interconnect_aresetn] [get_bd_pins axi_interconnect_0/ARESETN]
connect_bd_net [get_bd_pins axi_cfg_register_0/cfg_data] [get_bd_pins cfg_data]
connect_bd_net -net gpio_io_i_1 [get_bd_pins gpio_io_0_x1] [get_bd_pins axi_gpio_0/gpio_io_i]
connect_bd_net -net gpio2_io_i_1 [get_bd_pins gpio_io_0_x2] [get_bd_pins axi_gpio_0/gpio2_io_i]
connect_bd_net [get_bd_pins slowest_sync_clk] [get_bd_pins proc_sys_reset_0/slowest_sync_clk]
connect_bd_net [get_bd_pins proc_sys_reset_0/peripheral_aresetn] [get_bd_pins peripheral_aresetn]
connect_bd_net [get_bd_pins proc_sys_reset_0/interconnect_aresetn] [get_bd_pins interconnect_aresetn1]
connect_bd_net -net gpio_io_i1_1 [get_bd_pins gpio_io_1_x3] [get_bd_pins axi_gpio_1/gpio_io_i]
connect_bd_net -net gpio2_io_i1_1 [get_bd_pins gpio_io_1_x4] [get_bd_pins axi_gpio_1/gpio2_io_i]
connect_bd_net -net gpio_io_i3_1 [get_bd_pins gpio_io_3_x7] [get_bd_pins axi_gpio_3/gpio_io_i]
connect_bd_net -net gpio2_io_i3_1 [get_bd_pins gpio_io_3_x8] [get_bd_pins axi_gpio_3/gpio2_io_i]
connect_bd_net -net gpio2_io_i4_1 [get_bd_pins gpio_io_2_x6] [get_bd_pins axi_gpio_2/gpio2_io_i]
connect_bd_net -net gpio_io_i4_1 [get_bd_pins gpio_io_2_x5] [get_bd_pins axi_gpio_2/gpio_io_i]
connect_bd_net -net gpio_io_i_2 [get_bd_pins gpio_io_4_x9] [get_bd_pins axi_gpio_4/gpio_io_i]
connect_bd_net -net gpio2_io_i_2 [get_bd_pins gpio_io_4_x10] [get_bd_pins axi_gpio_4/gpio2_io_i]
connect_bd_net -net gpio2_io_i_3 [get_bd_pins gpio_io_5_x12] [get_bd_pins axi_gpio_5/gpio2_io_i]
connect_bd_net -net gpio_io_i_3 [get_bd_pins gpio_io_5_x11] [get_bd_pins axi_gpio_5/gpio_io_i]
connect_bd_net [get_bd_pins SPI0_MISO_I] [get_bd_pins processing_system7_0/SPI0_MISO_I]
connect_bd_net [get_bd_pins processing_system7_0/SPI0_MOSI_O] [get_bd_pins SPI0_MOSI_O]
connect_bd_net [get_bd_pins processing_system7_0/SPI0_SCLK_O] [get_bd_pins SPI0_SCLK_O]
connect_bd_net [get_bd_pins processing_system7_0/SPI0_SS_O] [get_bd_pins SPI0_SS_O]
connect_bd_net [get_bd_pins SPI0_SCLK_I] [get_bd_pins processing_system7_0/SPI0_SCLK_I]

current_bd_instance /PS_Amplitude_Controller
connect_bd_intf_net [get_bd_intf_pins amplitude_controller/S_AXIS_reset] [get_bd_intf_pins cfg_to_axis_volume/M_AXIS]
connect_bd_intf_net [get_bd_intf_pins M_AXIS_CONTROL] [get_bd_intf_pins amplitude_controller/M_AXIS_CONTROL]
connect_bd_intf_net [get_bd_intf_pins M_AXIS_PASS] [get_bd_intf_pins amplitude_controller/M_AXIS_PASS]
connect_bd_intf_net -intf_net cordic_sqrt_M_AXIS_DOUT [get_bd_intf_pins S_AXIS] [get_bd_intf_pins amplitude_controller/S_AXIS]
connect_bd_intf_net [get_bd_intf_pins M_AXIS_CONTROL2] [get_bd_intf_pins amplitude_controller/M_AXIS_CONTROL2]
connect_bd_intf_net [get_bd_intf_pins M_AXIS_PASS2] [get_bd_intf_pins amplitude_controller/M_AXIS_PASS2]
connect_bd_net -net PS_cfg_data [get_bd_pins cfg] \
  [get_bd_pins cfg_to_am_ci/cfg] [get_bd_pins cfg_to_am_upper/cfg] [get_bd_pins cfg_to_am_cp/cfg] \
  [get_bd_pins cfg_to_am_lower/cfg] [get_bd_pins cfg_to_axis_volume/cfg] [get_bd_pins cfg_to_am_setpoint/cfg]
connect_bd_net -net axis_red_pitaya_adc_0_adc_clk [get_bd_pins aclk] \
  [get_bd_pins cfg_to_am_ci/a_clk] [get_bd_pins cfg_to_am_upper/a_clk] [get_bd_pins cfg_to_am_cp/a_clk] \
  [get_bd_pins cfg_to_am_lower/a_clk] [get_bd_pins cfg_to_axis_volume/a_clk] [get_bd_pins cfg_to_am_setpoint/a_clk] \
  [get_bd_pins amplitude_controller/aclk]
connect_bd_net [get_bd_pins amplitude_controller/mon_signal] [get_bd_pins mon_signal]
connect_bd_net [get_bd_pins cfg_to_am_setpoint/data] [get_bd_pins amplitude_controller/setpoint]
connect_bd_net [get_bd_pins cfg_to_am_cp/data] [get_bd_pins amplitude_controller/cp]
connect_bd_net [get_bd_pins cfg_to_am_ci/data] [get_bd_pins amplitude_controller/ci]
connect_bd_net [get_bd_pins cfg_to_am_upper/data] [get_bd_pins amplitude_controller/limit_upper]
connect_bd_net [get_bd_pins enable] [get_bd_pins amplitude_controller/enable]
connect_bd_net [get_bd_pins cfg_to_am_lower/data] [get_bd_pins amplitude_controller/limit_lower]
connect_bd_net [get_bd_pins amplitude_controller/status_max] [get_bd_pins status_max]
connect_bd_net [get_bd_pins amplitude_controller/status_min] [get_bd_pins status_min]
connect_bd_net [get_bd_pins amplitude_controller/mon_control] [get_bd_pins mon_control]
connect_bd_net [get_bd_pins amplitude_controller/mon_control_lower32] [get_bd_pins mon_control_lower32]

current_bd_instance /PS_Phase_Controller
connect_bd_intf_net [get_bd_intf_pins phase_controller/S_AXIS_reset] [get_bd_intf_pins cfg_to_axis_PhaseInc/M_AXIS]
connect_bd_intf_net [get_bd_intf_pins phase_unwrap_0/M_AXIS] [get_bd_intf_pins phase_controller/S_AXIS]
connect_bd_intf_net [get_bd_intf_pins M_AXIS_CONTROL] [get_bd_intf_pins phase_controller/M_AXIS_CONTROL]
connect_bd_intf_net [get_bd_intf_pins M_AXIS_PASS] [get_bd_intf_pins phase_controller/M_AXIS_PASS]
connect_bd_intf_net [get_bd_intf_pins S_AXIS] [get_bd_intf_pins phase_unwrap_0/S_AXIS]
connect_bd_intf_net [get_bd_intf_pins M_AXIS_CONTROL2] [get_bd_intf_pins phase_controller/M_AXIS_CONTROL2]
connect_bd_intf_net [get_bd_intf_pins M_AXIS_PASS2] [get_bd_intf_pins phase_controller/M_AXIS_PASS2]
connect_bd_net -net axis_red_pitaya_adc_0_adc_clk [get_bd_pins aclk] \
  [get_bd_pins cfg_to_ph_ci/a_clk] [get_bd_pins cfg_to_ph_cp/a_clk] [get_bd_pins cfg_to_ph_upper/a_clk] \
  [get_bd_pins cfg_to_ph_setpoint/a_clk] [get_bd_pins cfg_to_ph_lower/a_clk] [get_bd_pins cfg_to_axis_PhaseInc/a_clk] \
  [get_bd_pins phase_unwrap_0/aclk] [get_bd_pins phase_controller/aclk]
connect_bd_net [get_bd_pins cfg] \
  [get_bd_pins cfg_to_ph_ci/cfg] [get_bd_pins cfg_to_ph_cp/cfg] [get_bd_pins cfg_to_ph_upper/cfg] \
  [get_bd_pins cfg_to_ph_setpoint/cfg] [get_bd_pins cfg_to_ph_lower/cfg] [get_bd_pins cfg_to_axis_PhaseInc/cfg] \
  [get_bd_pins cfg_select_phase_unwrapping/cfg]
connect_bd_net -net cfg_to_am_setpoint_data [get_bd_pins cfg_to_ph_setpoint/data] [get_bd_pins phase_controller/setpoint]
connect_bd_net [get_bd_pins cfg_to_ph_cp/data] [get_bd_pins phase_controller/cp]
connect_bd_net [get_bd_pins cfg_to_ph_ci/data] [get_bd_pins phase_controller/ci]
connect_bd_net -net cfg_to_ph_lower_data [get_bd_pins cfg_to_ph_upper/data] [get_bd_pins phase_controller/limit_upper]
connect_bd_net -net cfg_to_ph_upper_data [get_bd_pins cfg_to_ph_lower/data] [get_bd_pins data_lower] [get_bd_pins phase_controller/limit_lower]
connect_bd_net [get_bd_pins phase_controller/mon_signal] [get_bd_pins mon_signal]
connect_bd_net [get_bd_pins enable] [get_bd_pins logic_or_0/A] [get_bd_pins phase_controller/enable]
connect_bd_net [get_bd_pins phase_controller/status_min] [get_bd_pins status_min]
connect_bd_net [get_bd_pins phase_controller/status_max] [get_bd_pins status_max]
connect_bd_net [get_bd_pins phase_controller/mon_control] [get_bd_pins mon_control]
connect_bd_net [get_bd_pins phase_controller/mon_control_lower32] [get_bd_pins mon_control_lower32]
connect_bd_net [get_bd_pins logic_or_0/AorB] [get_bd_pins phase_unwrap_0/enable]
connect_bd_net [get_bd_pins cfg_select_phase_unwrapping/status] [get_bd_pins logic_or_0/B]
connect_bd_net [get_bd_pins phase_controller/mon_control_B] [get_bd_pins mon_control_B]

current_bd_instance /PS_data_transport
connect_bd_intf_net [get_bd_intf_pins axis_4s_combine_0/M_AXIS_aux] [get_bd_intf_pins ScaleAndAdjust_0/S_AXIS]
connect_bd_intf_net [get_bd_intf_pins axis_4s_combine_0/M_AXIS_CH1] [get_bd_intf_pins McBSP_controller_0/S_AXIS1]
connect_bd_intf_net [get_bd_intf_pins axis_4s_combine_0/M_AXIS_CH2] [get_bd_intf_pins McBSP_controller_0/S_AXIS2]
connect_bd_intf_net [get_bd_intf_pins axis_4s_combine_0/M_AXIS_CH3] [get_bd_intf_pins McBSP_controller_0/S_AXIS3]
connect_bd_intf_net [get_bd_intf_pins axis_4s_combine_0/M_AXIS_CH4] [get_bd_intf_pins McBSP_controller_0/S_AXIS4]
connect_bd_intf_net [get_bd_intf_pins axis_4s_combine_0/M_AXIS_FREQ63_32] [get_bd_intf_pins McBSP_controller_0/S_AXIS7]
connect_bd_intf_net [get_bd_intf_pins axis_4s_combine_0/M_AXIS_FREQ31_0] [get_bd_intf_pins McBSP_controller_0/S_AXIS8]
connect_bd_intf_net [get_bd_intf_pins axis_4s_combine_0/M_AXIS_AMPL] [get_bd_intf_pins McBSP_controller_0/S_AXIS5]
connect_bd_intf_net [get_bd_intf_pins axis_4s_combine_0/M_AXIS_PHASE] [get_bd_intf_pins McBSP_controller_0/S_AXIS6]
connect_bd_intf_net -intf_net lms_phase_amplitude_detector_0_M_AXIS_SIGNAL [get_bd_intf_pins S_AXIS1] [get_bd_intf_pins axis_4s_combine_0/S_AXIS1]
connect_bd_intf_net -intf_net PS_Amplitude_Controller_M_AXIS_CONTROL2 [get_bd_intf_pins S_AXIS2] [get_bd_intf_pins axis_4s_combine_0/S_AXIS2]
connect_bd_intf_net -intf_net PS_Phase_Controller_M_AXIS_CONTROL2 [get_bd_intf_pins S_AXIS3] [get_bd_intf_pins axis_4s_combine_0/S_AXIS3]
connect_bd_intf_net -intf_net PS_Phase_Controller_M_AXIS_PASS2 [get_bd_intf_pins S_AXIS4] [get_bd_intf_pins axis_4s_combine_0/S_AXIS4]
connect_bd_intf_net -intf_net PS_Amplitude_Controller_M_AXIS_PASS2 [get_bd_intf_pins S_AXIS5] [get_bd_intf_pins axis_4s_combine_0/S_AXIS5]
connect_bd_intf_net -intf_net PS_BRAM_PORTA [get_bd_intf_pins BRAM_PORTB] [get_bd_intf_pins blk_mem_gen_0/BRAM_PORTB]
connect_bd_intf_net [get_bd_intf_pins S_AXIS7] [get_bd_intf_pins axis_4s_combine_0/S_AXIS7]
connect_bd_intf_net [get_bd_intf_pins S_AXIS8] [get_bd_intf_pins axis_4s_combine_0/S_AXIS8]
connect_bd_intf_net [get_bd_intf_pins M_AXIS_aux] [get_bd_intf_pins ScaleAndAdjust_0/M_AXIS]
connect_bd_net [get_bd_pins axis_4s_combine_0/bram_porta_clk] [get_bd_pins blk_mem_gen_0/clka]
connect_bd_net [get_bd_pins axis_4s_combine_0/bram_porta_addr] [get_bd_pins blk_mem_gen_0/addra]
connect_bd_net [get_bd_pins axis_4s_combine_0/bram_porta_wrdata] [get_bd_pins blk_mem_gen_0/dina]
connect_bd_net [get_bd_pins axis_4s_combine_0/bram_porta_en] [get_bd_pins blk_mem_gen_0/ena]
connect_bd_net [get_bd_pins axis_4s_combine_0/bram_porta_we] [get_bd_pins blk_mem_gen_0/wea]
connect_bd_net -net axis_red_pitaya_adc_0_adc_clk [get_bd_pins a_clk] \
  [get_bd_pins cfg_to_transport_decimation/a_clk] [get_bd_pins cfg_to_transport_channel_select/a_clk] \
  [get_bd_pins cfg_to_transport_control/a_clk] [get_bd_pins cfg_to_transport_nsamples/a_clk] \
  [get_bd_pins cfg17_to_transport_auxscale/a_clk] [get_bd_pins cfg18_19_to_transport_auxcenter/a_clk] \
  [get_bd_pins ScaleAndAdjust_0/a_clk] [get_bd_pins axis_4s_combine_0/a_clk] [get_bd_pins McBSP_controller_0/a_clk]
connect_bd_net [get_bd_pins cfg] \
  [get_bd_pins cfg_to_transport_decimation/cfg] [get_bd_pins cfg_to_transport_channel_select/cfg] \
  [get_bd_pins cfg_to_transport_control/cfg] [get_bd_pins cfg_to_transport_nsamples/cfg] \
  [get_bd_pins cfg17_to_transport_auxscale/cfg] [get_bd_pins cfg18_19_to_transport_auxcenter/cfg]
connect_bd_net -net cfg_to_transport_data [get_bd_pins cfg_to_transport_decimation/data] [get_bd_pins axis_4s_combine_0/ndecimate]
connect_bd_net -net cfg_to_channel_select_data [get_bd_pins cfg_to_transport_channel_select/data] [get_bd_pins axis_4s_combine_0/channel_selector]
connect_bd_net -net cfg_to_transport_channel_select1_data [get_bd_pins cfg_to_transport_nsamples/data] [get_bd_pins axis_4s_combine_0/nsamples]
connect_bd_net [get_bd_pins axis_4s_combine_0/debug] [get_bd_pins debug]
connect_bd_net [get_bd_pins axis_4s_combine_0/writeposition] [get_bd_pins writeposition]
connect_bd_net [get_bd_pins cfg_to_transport_control/data] [get_bd_pins axis_4s_combine_0/operation]
connect_bd_net [get_bd_pins axis_4s_combine_0/finished_state] [get_bd_pins finished_state]
connect_bd_net [get_bd_pins axis_4s_combine_0/init_state] [get_bd_pins init_state]
connect_bd_net -net cfg_to_axis_0_data [get_bd_pins cfg17_to_transport_auxscale/data] [get_bd_pins ScaleAndAdjust_0/gain]
connect_bd_net [get_bd_pins cfg18_19_to_transport_auxcenter/data] [get_bd_pins axis_4s_combine_0/axis3_center]
connect_bd_net [get_bd_pins McBSP_io_connect_0/McBSP_clk] [get_bd_pins McBSP_controller_0/mcbsp_clk]
connect_bd_net [get_bd_pins McBSP_io_connect_0/McBSP_fs] [get_bd_pins McBSP_controller_0/mcbsp_frame_start]
connect_bd_net [get_bd_pins McBSP_io_connect_0/McBSP_rx] [get_bd_pins McBSP_controller_0/mcbsp_data_rx]
connect_bd_net [get_bd_pins McBSP_controller_0/mcbsp_data_tx] [get_bd_pins McBSP_io_connect_0/McBSP_tx]
connect_bd_net [get_bd_pins McBSP_io_connect_0/RP_exp_in] [get_bd_pins axis_4s_combine_0/rp_digital_in]
connect_bd_net [get_bd_pins exp_p_io] [get_bd_pins McBSP_io_connect_0/exp_p_io]
connect_bd_net [get_bd_pins exp_n_io] [get_bd_pins McBSP_io_connect_0/exp_n_io]
connect_bd_net [get_bd_pins McBSP_controller_0/trigger] [get_bd_pins axis_4s_combine_0/ext_trigger]
connect_bd_net [get_bd_pins McBSP_controller_0/mcbsp_data_fsx] [get_bd_pins McBSP_io_connect_0/McBSP_fsx]
connect_bd_net [get_bd_pins McBSP_controller_0/mcbsp_data_frm] [get_bd_pins McBSP_io_connect_0/McBSP_frm]
connect_bd_net [get_bd_pins McBSP_io_connect_0/McBSP_nrx] [get_bd_pins McBSP_controller_0/mcbsp_data_nrx]

current_bd_instance /
connect_bd_intf_net [get_bd_intf_pins axis_sc26_to_14_0/M_AXIS] [get_bd_intf_pins VolumeAdjuster16_14_and_QCtrl/S_AXIS]
connect_bd_intf_net [get_bd_intf_pins axis_sc26_to_14_0/S_AXIS] [get_bd_intf_pins lms_phase_amplitude_detector_0/M_AXIS_SC]
connect_bd_intf_net -intf_net VolumeAdjuster16_14_0_M_AXIS [get_bd_intf_pins VolumeAdjuster16_14_and_QCtrl/M_AXIS] [get_bd_intf_pins axis_red_pitaya_dac_0/S_AXIS]
connect_bd_intf_net [get_bd_intf_pins dds_compiler_0/M_AXIS_DATA] [get_bd_intf_pins lms_phase_amplitude_detector_0/S_AXIS_SC]
connect_bd_intf_net [get_bd_intf_pins lms_phase_amplitude_detector_0/S_AXIS_SIGNAL] [get_bd_intf_pins axis_red_pitaya_adc_0/M_AXIS]
connect_bd_intf_net [get_bd_intf_pins lms_phase_amplitude_detector_0/M_AXIS_AM2] [get_bd_intf_pins cordic_sqrt/S_AXIS_CARTESIAN]
connect_bd_intf_net [get_bd_intf_pins lms_phase_amplitude_detector_0/M_AXIS_XY] [get_bd_intf_pins cordic_atan_xy/S_AXIS_CARTESIAN]
connect_bd_intf_net [get_bd_intf_pins cordic_sqrt/M_AXIS_DOUT] [get_bd_intf_pins PS_Amplitude_Controller/S_AXIS]
connect_bd_intf_net [get_bd_intf_pins cordic_atan_xy/M_AXIS_DOUT] [get_bd_intf_pins PS_Phase_Controller/S_AXIS]
connect_bd_intf_net [get_bd_intf_pins PS_data_transport/S_AXIS2] [get_bd_intf_pins PS_Amplitude_Controller/M_AXIS_CONTROL2]
connect_bd_intf_net [get_bd_intf_pins PS_data_transport/S_AXIS3] [get_bd_intf_pins PS_Phase_Controller/M_AXIS_CONTROL2]
connect_bd_intf_net [get_bd_intf_pins lms_phase_amplitude_detector_0/M_AXIS_SIGNAL] [get_bd_intf_pins PS_data_transport/S_AXIS1]
connect_bd_intf_net [get_bd_intf_pins PS_data_transport/S_AXIS4] [get_bd_intf_pins PS_Phase_Controller/M_AXIS_PASS2]
connect_bd_intf_net [get_bd_intf_pins PS_data_transport/S_AXIS5] [get_bd_intf_pins PS_Amplitude_Controller/M_AXIS_PASS2]
connect_bd_intf_net [get_bd_intf_pins PS_data_transport/BRAM_PORTB] [get_bd_intf_pins PS/BRAM_PORTA]
connect_bd_intf_net [get_bd_intf_pins PS_Phase_Controller/M_AXIS_CONTROL] [get_bd_intf_pins dds_compiler_0/S_AXIS_PHASE]
connect_bd_intf_net [get_bd_intf_pins VolumeAdjuster16_14_and_QCtrl/SV_AXIS] [get_bd_intf_pins PS_Amplitude_Controller/M_AXIS_CONTROL]
connect_bd_intf_net [get_bd_intf_pins axis_sc26_to_14_0/S_AXIS_aux] [get_bd_intf_pins PS_data_transport/M_AXIS_aux]
connect_bd_intf_net [get_bd_intf_pins lms_phase_amplitude_detector_0/M_AXIS_MDC] [get_bd_intf_pins PS_data_transport/S_AXIS7]
connect_bd_intf_net [get_bd_intf_pins lms_phase_amplitude_detector_0/M_AXIS_SIGNAL_M] [get_bd_intf_pins VolumeAdjuster16_14_and_QCtrl/S_AXIS_SIGNAL_M]
connect_bd_intf_net -intf_net processing_system7_0_DDR [get_bd_intf_ports DDR] [get_bd_intf_pins PS/DDR]
connect_bd_intf_net -intf_net processing_system7_0_FIXED_IO [get_bd_intf_ports FIXED_IO] [get_bd_intf_pins PS/FIXED_IO]
connect_bd_net [get_bd_ports adc_clk_p_i] [get_bd_pins axis_red_pitaya_adc_0/adc_clk_p]
connect_bd_net [get_bd_ports adc_clk_n_i] [get_bd_pins axis_red_pitaya_adc_0/adc_clk_n]
connect_bd_net [get_bd_ports daisy_p_i] [get_bd_pins util_ds_buf_1/IBUF_DS_P]
connect_bd_net [get_bd_ports daisy_n_i] [get_bd_pins util_ds_buf_1/IBUF_DS_N]
connect_bd_net [get_bd_pins util_ds_buf_2/OBUF_DS_P] [get_bd_ports daisy_p_o]
connect_bd_net [get_bd_pins util_ds_buf_2/OBUF_DS_N] [get_bd_ports daisy_n_o]
connect_bd_net [get_bd_pins util_ds_buf_1/IBUF_OUT] [get_bd_pins util_ds_buf_2/OBUF_IN]
connect_bd_net [get_bd_ports adc_dat_a_i] [get_bd_pins axis_red_pitaya_adc_0/adc_dat_a]
connect_bd_net [get_bd_ports adc_dat_b_i] [get_bd_pins axis_red_pitaya_adc_0/adc_dat_b]
connect_bd_net [get_bd_pins axis_red_pitaya_dac_0/dac_rst] [get_bd_ports dac_rst_o]
connect_bd_net [get_bd_pins axis_red_pitaya_dac_0/dac_sel] [get_bd_ports dac_sel_o]
connect_bd_net [get_bd_pins axis_red_pitaya_dac_0/dac_wrt] [get_bd_ports dac_wrt_o]
connect_bd_net [get_bd_pins axis_red_pitaya_dac_0/dac_clk] [get_bd_ports dac_clk_o]
connect_bd_net [get_bd_pins axis_red_pitaya_dac_0/dac_dat] [get_bd_ports dac_dat_o]
connect_bd_net [get_bd_pins axis_red_pitaya_adc_0/adc_clk] \
  [get_bd_pins axis_red_pitaya_dac_0/aclk] [get_bd_pins clk_wiz_0/clk_in1] [get_bd_pins cordic_sqrt/aclk] \
  [get_bd_pins cordic_atan_xy/aclk] [get_bd_pins dds_compiler_0/aclk] [get_bd_pins cfg_to_axis_tau/a_clk] \
  [get_bd_pins cfg_to_axis_dc/a_clk] [get_bd_pins axis_sc26_to_14_0/a_clk] [get_bd_pins cfg_to_axis_Atau/a_clk] \
  [get_bd_pins cfg_to_axis_dc_tau/a_clk] [get_bd_pins cfg_to_axis_qc_gain/a_clk] [get_bd_pins cfg_to_axis_qc_delay/a_clk] \
  [get_bd_pins VolumeAdjuster16_14_and_QCtrl/a_clk] [get_bd_pins lms_phase_amplitude_detector_0/aclk] \
  [get_bd_pins PS/slowest_sync_clk] [get_bd_pins PS_Amplitude_Controller/aclk] [get_bd_pins PS_Phase_Controller/aclk] \
  [get_bd_pins PS_data_transport/a_clk]
connect_bd_net [get_bd_pins axis_red_pitaya_adc_0/adc_csn] [get_bd_ports adc_csn_o]
connect_bd_net [get_bd_pins clk_wiz_0/locked] [get_bd_pins axis_red_pitaya_dac_0/locked]
connect_bd_net [get_bd_pins clk_wiz_0/clk_out1] [get_bd_pins axis_red_pitaya_dac_0/ddr_clk]
connect_bd_net [get_bd_pins PS/cfg_data] \
  [get_bd_pins cfg_select_amplitude_control/cfg] [get_bd_pins cfg_select_phase_control/cfg] [get_bd_pins cfg_to_axis_tau/cfg] \
  [get_bd_pins cfg_to_axis_dc/cfg] [get_bd_pins cfg_to_axis_Atau/cfg] [get_bd_pins cfg_to_axis_dc_tau/cfg] \
  [get_bd_pins cfg_to_axis_qc_gain/cfg] [get_bd_pins cfg_to_axis_qc_delay/cfg] [get_bd_pins cfg_select_qcontrol/cfg] \
  [get_bd_pins cfg_select_lck_ampl_control/cfg] [get_bd_pins cfg_select_lck_phase_control1/cfg] \
  [get_bd_pins PS_Amplitude_Controller/cfg] [get_bd_pins PS_Phase_Controller/cfg] [get_bd_pins PS_data_transport/cfg]
connect_bd_net [get_bd_pins cfg_to_axis_tau/M_AXIS_tdata] [get_bd_pins lms_phase_amplitude_detector_0/tau]
connect_bd_net [get_bd_pins lms_phase_amplitude_detector_0/Aout] [get_bd_pins PS/gpio_io_0_x1]
connect_bd_net [get_bd_pins lms_phase_amplitude_detector_0/Bout] [get_bd_pins PS/gpio_io_0_x2]
connect_bd_net [get_bd_pins lms_phase_amplitude_detector_0/dbg1] [get_bd_pins PS/gpio_io_1_x3]
connect_bd_net [get_bd_pins cfg_to_axis_dc/M_AXIS_tdata] [get_bd_pins lms_phase_amplitude_detector_0/dc]
connect_bd_net -net amplitude_controller_mon_signal [get_bd_pins PS_Amplitude_Controller/mon_signal] [get_bd_pins PS/gpio_io_1_x4]
connect_bd_net [get_bd_pins led_connect_0/leds] [get_bd_ports led_o]
connect_bd_net -net cfg_axis_volume_status [get_bd_pins cfg_select_amplitude_control/status] \
  [get_bd_pins led_connect_0/led1] [get_bd_pins PS_Amplitude_Controller/enable]
connect_bd_net -net cfg_axis_phaseinc_status [get_bd_pins cfg_select_phase_control/status] \
  [get_bd_pins led_connect_0/led4] [get_bd_pins PS_Phase_Controller/enable]
connect_bd_net -net gpio2_io_i_1 [get_bd_pins PS_Phase_Controller/mon_signal] [get_bd_pins PS/gpio_io_4_x10]
connect_bd_net [get_bd_pins PS_data_transport/debug] [get_bd_pins PS/gpio_io_5_x12]
connect_bd_net [get_bd_pins PS_data_transport/writeposition] [get_bd_pins PS/gpio_io_5_x11]
connect_bd_net -net axis3_lower_1 [get_bd_pins PS_Phase_Controller/data_lower] [get_bd_pins PS_data_transport/axis3_lower]
connect_bd_net [get_bd_pins PS_Amplitude_Controller/status_max] [get_bd_pins led_connect_0/led3]
connect_bd_net [get_bd_pins PS_Amplitude_Controller/status_min] [get_bd_pins led_connect_0/led2]
connect_bd_net [get_bd_pins PS_Phase_Controller/status_min] [get_bd_pins led_connect_0/led5]
connect_bd_net [get_bd_pins PS_Phase_Controller/status_max] [get_bd_pins led_connect_0/led6]
connect_bd_net [get_bd_pins PS_data_transport/finished_state] [get_bd_pins led_connect_0/led8]
connect_bd_net [get_bd_pins PS_data_transport/init_state] [get_bd_pins led_connect_0/led7]
connect_bd_net -net gpio_io_3_x7_1 [get_bd_pins PS_Amplitude_Controller/mon_control] [get_bd_pins PS/gpio_io_3_x7]
connect_bd_net -net gpio_io_3_x8_1 [get_bd_pins PS_Phase_Controller/mon_control] [get_bd_pins PS/gpio_io_3_x8]
connect_bd_net -net gpio_io_4_x9_1 [get_bd_pins PS_Phase_Controller/mon_control_lower32] [get_bd_pins PS/gpio_io_4_x9]
connect_bd_net -net gpio_io_2_x6_1 [get_bd_pins PS_Amplitude_Controller/mon_control_lower32] [get_bd_pins PS/gpio_io_2_x6]
connect_bd_net [get_bd_pins cfg_to_axis_Atau/M_AXIS_tdata] [get_bd_pins lms_phase_amplitude_detector_0/Atau]
connect_bd_net [get_bd_pins lms_phase_amplitude_detector_0/dbg2] [get_bd_pins PS/gpio_io_2_x5]
connect_bd_net [get_bd_pins cfg_to_axis_dc_tau/M_AXIS_tdata] [get_bd_pins lms_phase_amplitude_detector_0/dc_tau]
connect_bd_net [get_bd_pins cfg_to_axis_qc_gain/data] [get_bd_pins VolumeAdjuster16_14_and_QCtrl/QC_gain]
connect_bd_net [get_bd_pins cfg_to_axis_qc_delay/data] [get_bd_pins VolumeAdjuster16_14_and_QCtrl/QC_delay]
connect_bd_net [get_bd_pins cfg_select_qcontrol/status] [get_bd_pins VolumeAdjuster16_14_and_QCtrl/QC_enable]
connect_bd_net [get_bd_pins PS_Phase_Controller/mon_control_B] [get_bd_pins lms_phase_amplitude_detector_0/DDS_dphi]
connect_bd_net [get_bd_pins cfg_select_lck_ampl_control/status] [get_bd_pins lms_phase_amplitude_detector_0/lck_ampl]
connect_bd_net [get_bd_pins cfg_select_lck_phase_control1/status] [get_bd_pins lms_phase_amplitude_detector_0/lck_phase]
connect_bd_net [get_bd_ports exp_p_io] [get_bd_pins PS_data_transport/exp_p_io]
connect_bd_net [get_bd_ports exp_n_io] [get_bd_pins PS_data_transport/exp_n_io]

# ---- address map ----
assign_bd_address -offset 0x40000000 -range 2M -target_address_space [get_bd_addr_spaces PS/processing_system7_0/Data] [get_bd_addr_segs PS/axi_bram_reader_0/s00_axi/reg0]
assign_bd_address -offset 0x42000000 -range 4K -target_address_space [get_bd_addr_spaces PS/processing_system7_0/Data] [get_bd_addr_segs PS/axi_cfg_register_0/s_axi/reg0]
assign_bd_address -offset 0x42001000 -range 4K -target_address_space [get_bd_addr_spaces PS/processing_system7_0/Data] [get_bd_addr_segs PS/axi_gpio_0/S_AXI/Reg]
assign_bd_address -offset 0x42002000 -range 4K -target_address_space [get_bd_addr_spaces PS/processing_system7_0/Data] [get_bd_addr_segs PS/axi_gpio_1/S_AXI/Reg]
assign_bd_address -offset 0x42003000 -range 4K -target_address_space [get_bd_addr_spaces PS/processing_system7_0/Data] [get_bd_addr_segs PS/axi_gpio_2/S_AXI/Reg]
assign_bd_address -offset 0x42004000 -range 4K -target_address_space [get_bd_addr_spaces PS/processing_system7_0/Data] [get_bd_addr_segs PS/axi_gpio_3/S_AXI/Reg]
assign_bd_address -offset 0x42005000 -range 4K -target_address_space [get_bd_addr_spaces PS/processing_system7_0/Data] [get_bd_addr_segs PS/axi_gpio_4/S_AXI/Reg]
assign_bd_address -offset 0x42006000 -range 4K -target_address_space [get_bd_addr_spaces PS/processing_system7_0/Data] [get_bd_addr_segs PS/axi_gpio_5/S_AXI/Reg]

validate_bd_design
save_bd_design
